# Altium schematic sheet AminMourad_weatherstation__PCB_Altium__Sheet_1_2024-12-12.schdoc
size 168 x 129 mm
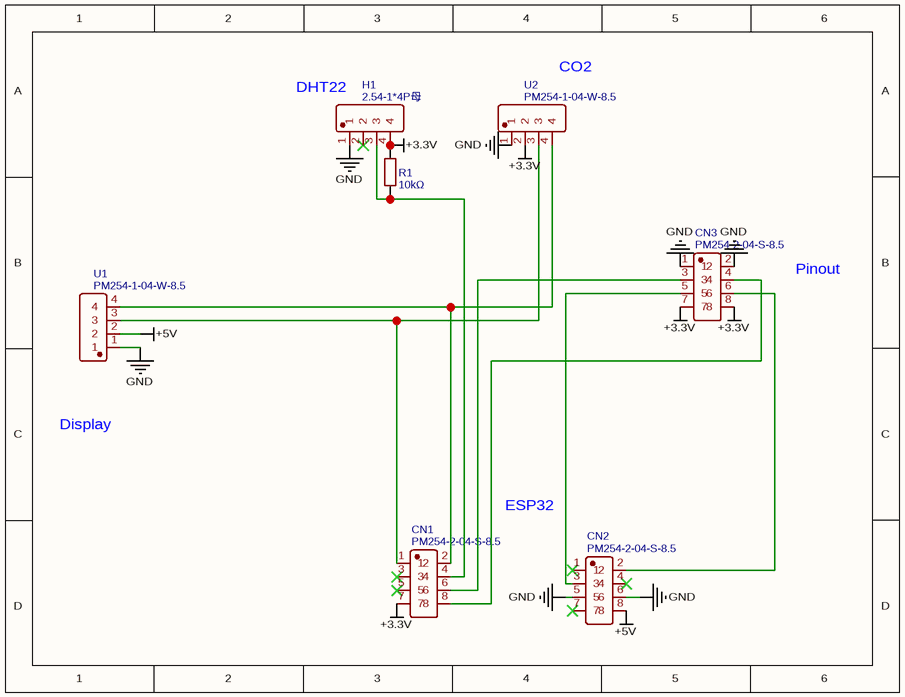
[diagram p0: AminMourad_weatherstation__PCB_Altium__Sheet_1_2024-12-12.schdoc]

## Parts
CN1  PM254-2-04-S-8.5  [HDR-SMD_8P-P2.54-V-F-R2-C4-S7.1]
CN2  PM254-2-04-S-8.5  [HDR-SMD_8P-P2.54-V-F-R2-C4-S7.1]
CN3  PM254-2-04-S-8.5  [HDR-SMD_8P-P2.54-V-F-R2-C4-S7.1]
H1  2.54-1*4P母  [HDR-TH_4P-P2.54-V-F]
R1  10kΩ  [R0603]
U1  PM254-1-04-W-8.5  [HDR-TH_4P-P2.54-H-F-W10.0-N]
U2  PM254-1-04-W-8.5  [HDR-TH_4P-P2.54-H-F-W10.0-N]

## Nets
+3.3V: CN1.7 CN3.7 CN3.8 H1.4 R1.2 U2.2
+5V: CN2.8 U1.2
GND: CN2.5 CN2.6 CN3.1 CN3.2 H1.1 U1.1 U2.1
NetCN1_1: CN1.1 U1.3 U2.3
NetCN1_2: CN1.2 U1.4 U2.4
NetCN1_4: CN1.4 H1.3 R1.1
NetCN1_6: CN1.6 CN3.3
NetCN1_8: CN1.8 CN3.4
NetCN2_2: CN2.2 CN3.6
NetCN2_3: CN2.3 CN3.5

Not connected (* = marked no-connect by the designer): CN1 3* 5*; CN2 1* 4* 7*; H1 2*

## Notes on the sheet
- (near H1) DHT22
- CO2
- Pinout
- Display
- ESP32

## Library data of the parts
CN1-CN3 = PM254-2-04-S-8.5: Manufacturer: HCTL(华灿天禄); Contributor: lcsc; Supplier: LCSC; Supplier Part: C3975149; Manufacturer Part: PM254-2-04-S-8.5; JLCPCB Part Class: Extended Part; spicePre: C; spiceSymbolName: PM254-2-04-S-8.5
H1 = 2.54-1*4P母: Manufacturer: BOOMELE(博穆精密); Contributor: LCSC; Supplier: LCSC; Supplier Part: C2718488; Manufacturer Part: 2.54-1*4P母; JLCPCB Part Class: Extended Part; spicePre: H; spiceSymbolName: 2.54-1*4P母
R1 = 10kΩ: Manufacturer: UNI-ROYAL(厚声); Manufacturer Part: 0603WAF1002T5E; nameAlias: Value; Supplier: LCSC; Supplier Part: C25804; JLCPCB Part Class: Basic Part; spicePre: R; spiceSymbolName: 0603WAF1002T5E
U1 U2 = PM254-1-04-W-8.5: Manufacturer: HCTL(华灿天禄); Contributor: LCSC; Supplier: LCSC; Supplier Part: C2897386; Manufacturer Part: PM254-1-04-W-8.5; JLCPCB Part Class: Extended Part; spicePre: U; spiceSymbolName: PM254-1-04-W-8.5